# Altium schematic sheet OSD19001_BRK_X2.SchDoc
size B; Organization: Altium Limited; DocumentNumber: 1; SheetNumber: 1; SheetTotal: 4; SchematicTitle: OSD32MP1 BREAKOUT MODULE
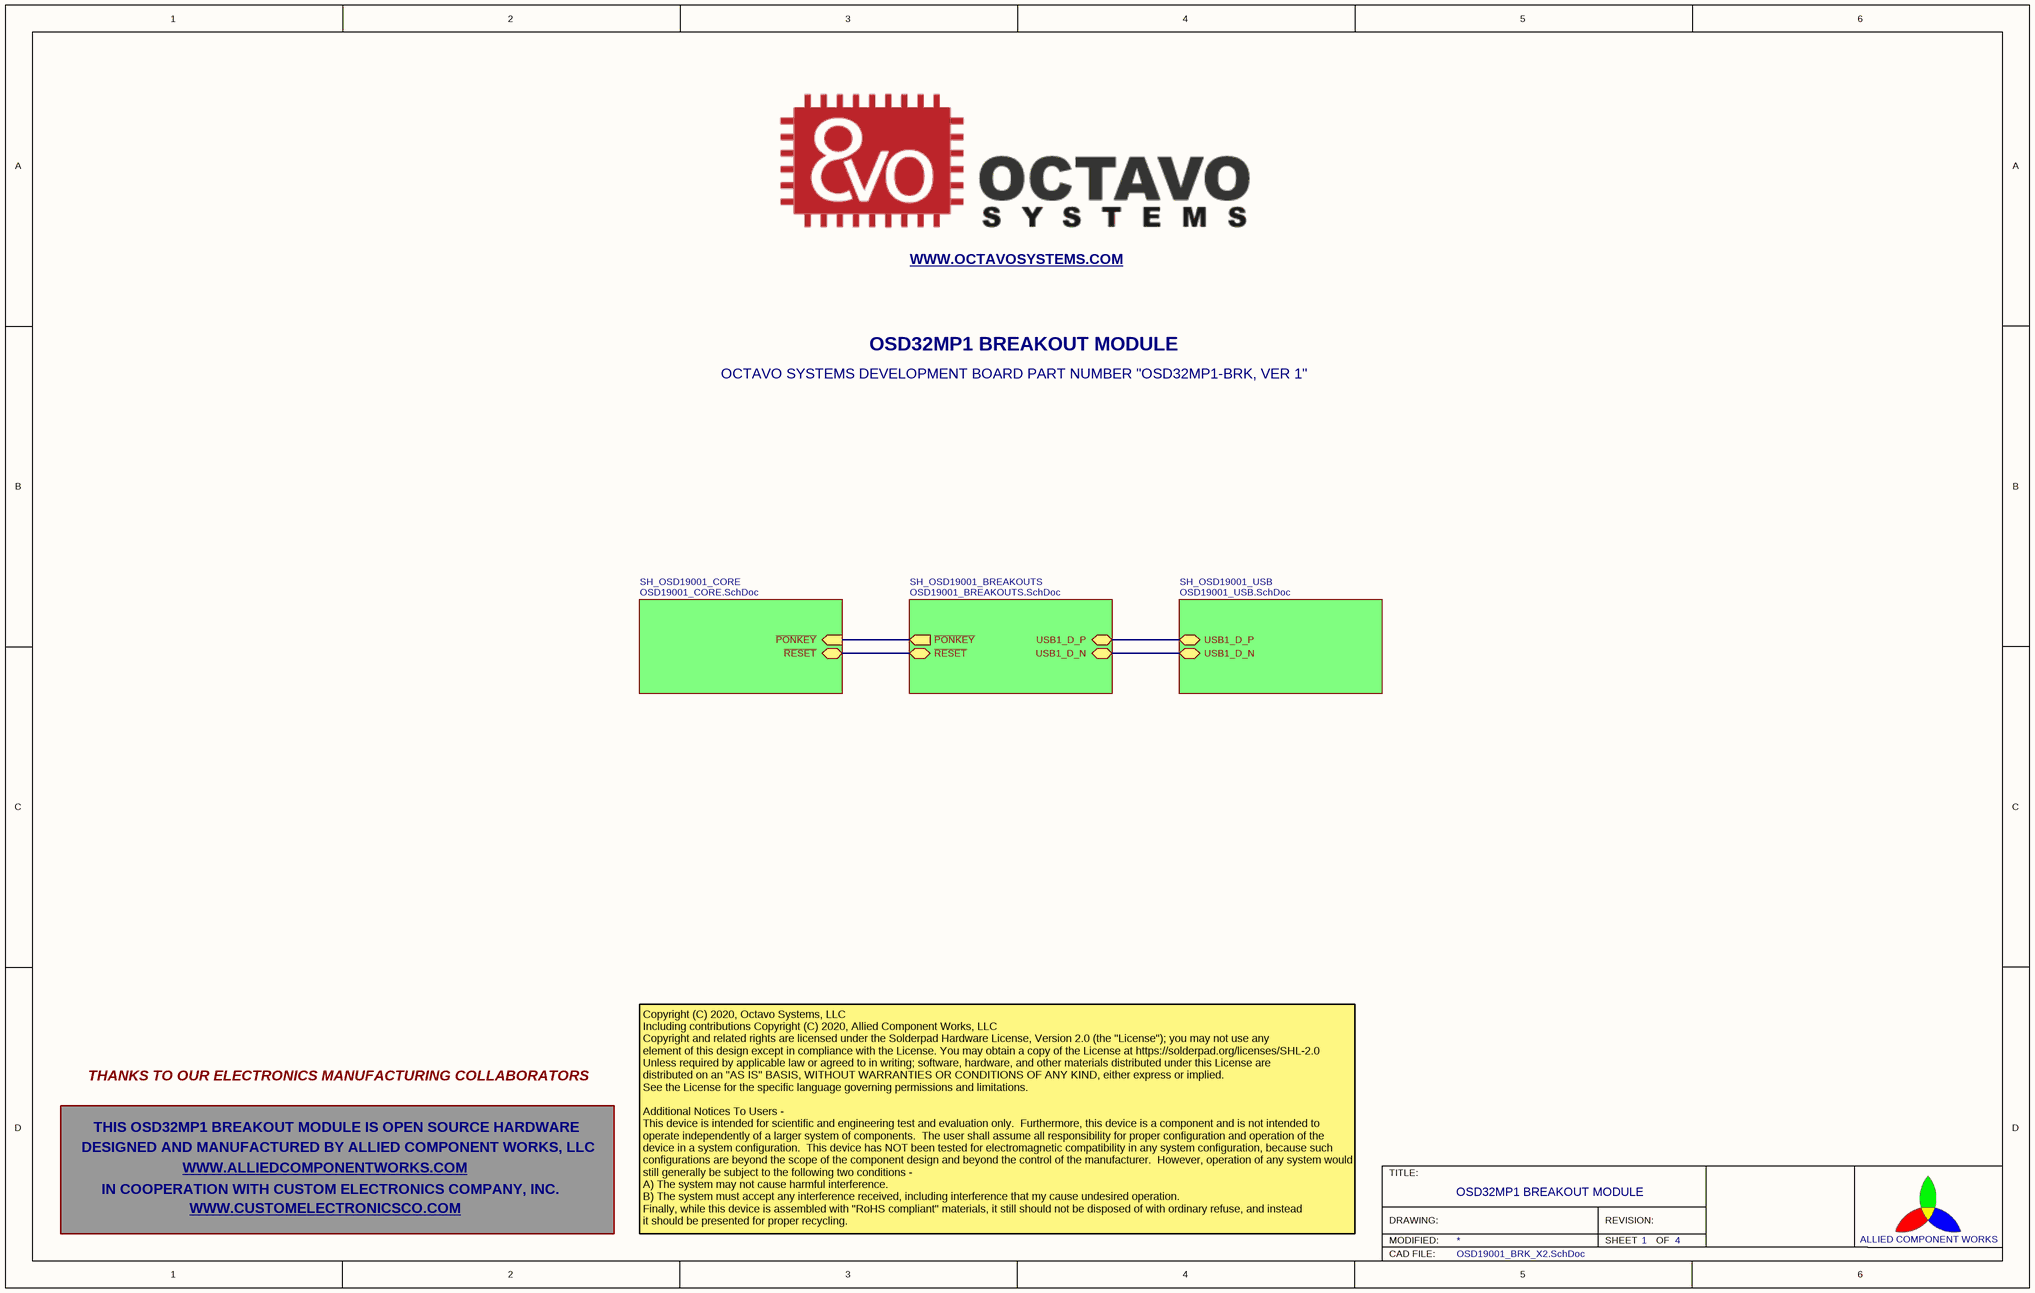
[diagram p0: OSD19001_BRK_X2.SchDoc]

## Sub-sheets
SH_OSD19001_BREAKOUTS = OSD19001_BREAKOUTS.SchDoc: ~{PONKEY} (out), ~{RESET} (bidir), USB1_D_P (bidir), USB1_D_N (bidir)
SH_OSD19001_CORE = OSD19001_CORE.SchDoc: ~{PONKEY} (in), ~{RESET} (bidir)
SH_OSD19001_USB = OSD19001_USB.SchDoc: USB1_D_P (bidir), USB1_D_N (bidir)

## Nets
(unnamed): sheet SH_OSD19001_CORE/~{PONKEY}, sheet SH_OSD19001_BREAKOUTS/~{PONKEY}
(unnamed): sheet SH_OSD19001_CORE/~{RESET}, sheet SH_OSD19001_BREAKOUTS/~{RESET}
(unnamed): sheet SH_OSD19001_BREAKOUTS/USB1_D_P, sheet SH_OSD19001_USB/USB1_D_P
(unnamed): sheet SH_OSD19001_BREAKOUTS/USB1_D_N, sheet SH_OSD19001_USB/USB1_D_N

## Notes on the sheet
- WWW.OCTAVOSYSTEMS.COM <http://WWW.OCTAVOSYSTEMS.COM>
- OSD32MP1 BREAKOUT MODULE
- OCTAVO SYSTEMS DEVELOPMENT BOARD PART NUMBER "OSD32MP1-BRK, VER 1"
- THANKS TO OUR ELECTRONICS MANUFACTURING COLLABORATORS
- DESIGNED AND MANUFACTURED BY ALLIED COMPONENT WORKS, LLC
- THIS OSD32MP1 BREAKOUT MODULE IS OPEN SOURCE HARDWARE
- WWW.ALLIEDCOMPONENTWORKS.COM <http://WWW.ALLIEDCOMPONENTWORKS.COM>
- IN COOPERATION WITH CUSTOM ELECTRONICS COMPANY, INC.
- WWW.CUSTOMELECTRONICSCO.COM <http://WWW.CUSTOMELECTRONICSCO.COM>
- Copyright (C) 2020, Octavo Systems, LLC
  Including contributions Copyright (C) 2020, Allied Component Works, LLC
  Copyright and related rights are licensed under the Solderpad Hardware License, Version 2.0 (the "License"); you may not use any
  element of this design except in compliance with the License. You may obtain a copy of the License at https://solderpad.org/licenses/SHL-2.0
  Unless required by applicable law or agreed to in writing; software, hardware, and other materials distributed under this License are
  distributed on an "AS IS" BASIS, WITHOUT WARRANTIES OR CONDITIONS OF ANY KIND, either express or implied.
  See the License for the specific language governing permissions and limitations.
  Additional Notices To Users -
  This device is intended for scientific and engineering test and evaluation only.  Furthermore, this device is a component and is not intended to operate independently of a larger system of components.  The user shall assume all responsibility for proper configuration and operation of the device in a system configuration.  This device has NOT been tested for electromagnetic compatibility in any system configuration, because such configurations are beyond the scope of the component design and beyond the control of the manufacturer.  However, operation of any system would still generally be subject to the following two conditions -
  A) The system may not cause harmful interference.
  B) The system must accept any interference received, including interference that my cause undesired operation.
  Finally, while this device is assembled with "RoHS compliant" materials, it still should not be disposed of with ordinary refuse, and instead
  it should be presented for proper recycling.
- TITLE:
- DRAWING:
- MODIFIED:
- REVISION:
- SHEET
- OF
- ALLIED COMPONENT WORKS
- CAD FILE: